# EAGLE schematic SonoluxV1fsch (EAGLE 9.7.0)
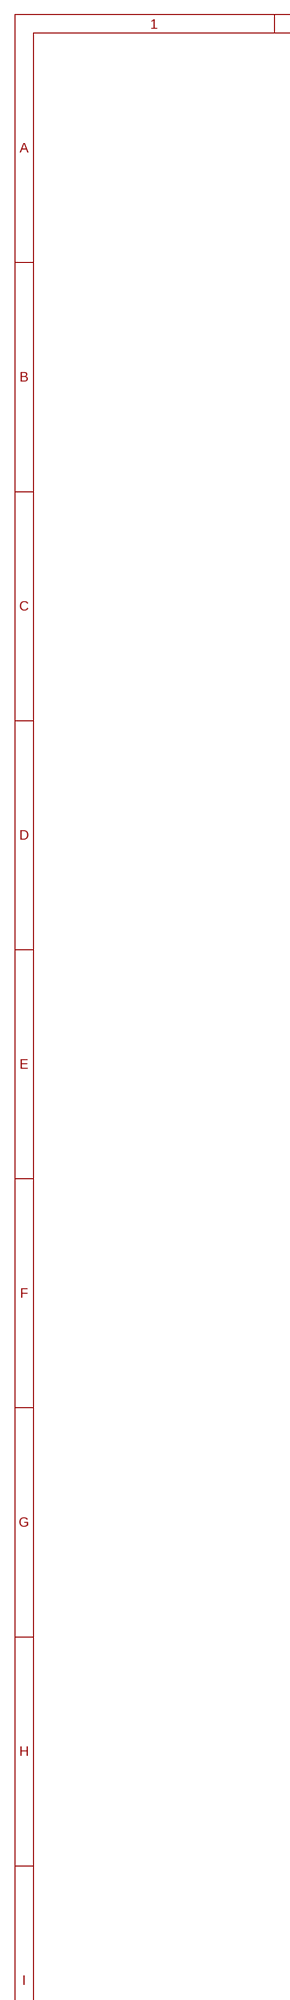
[diagram p0: schematic, sheet 1, part 1 of 2]
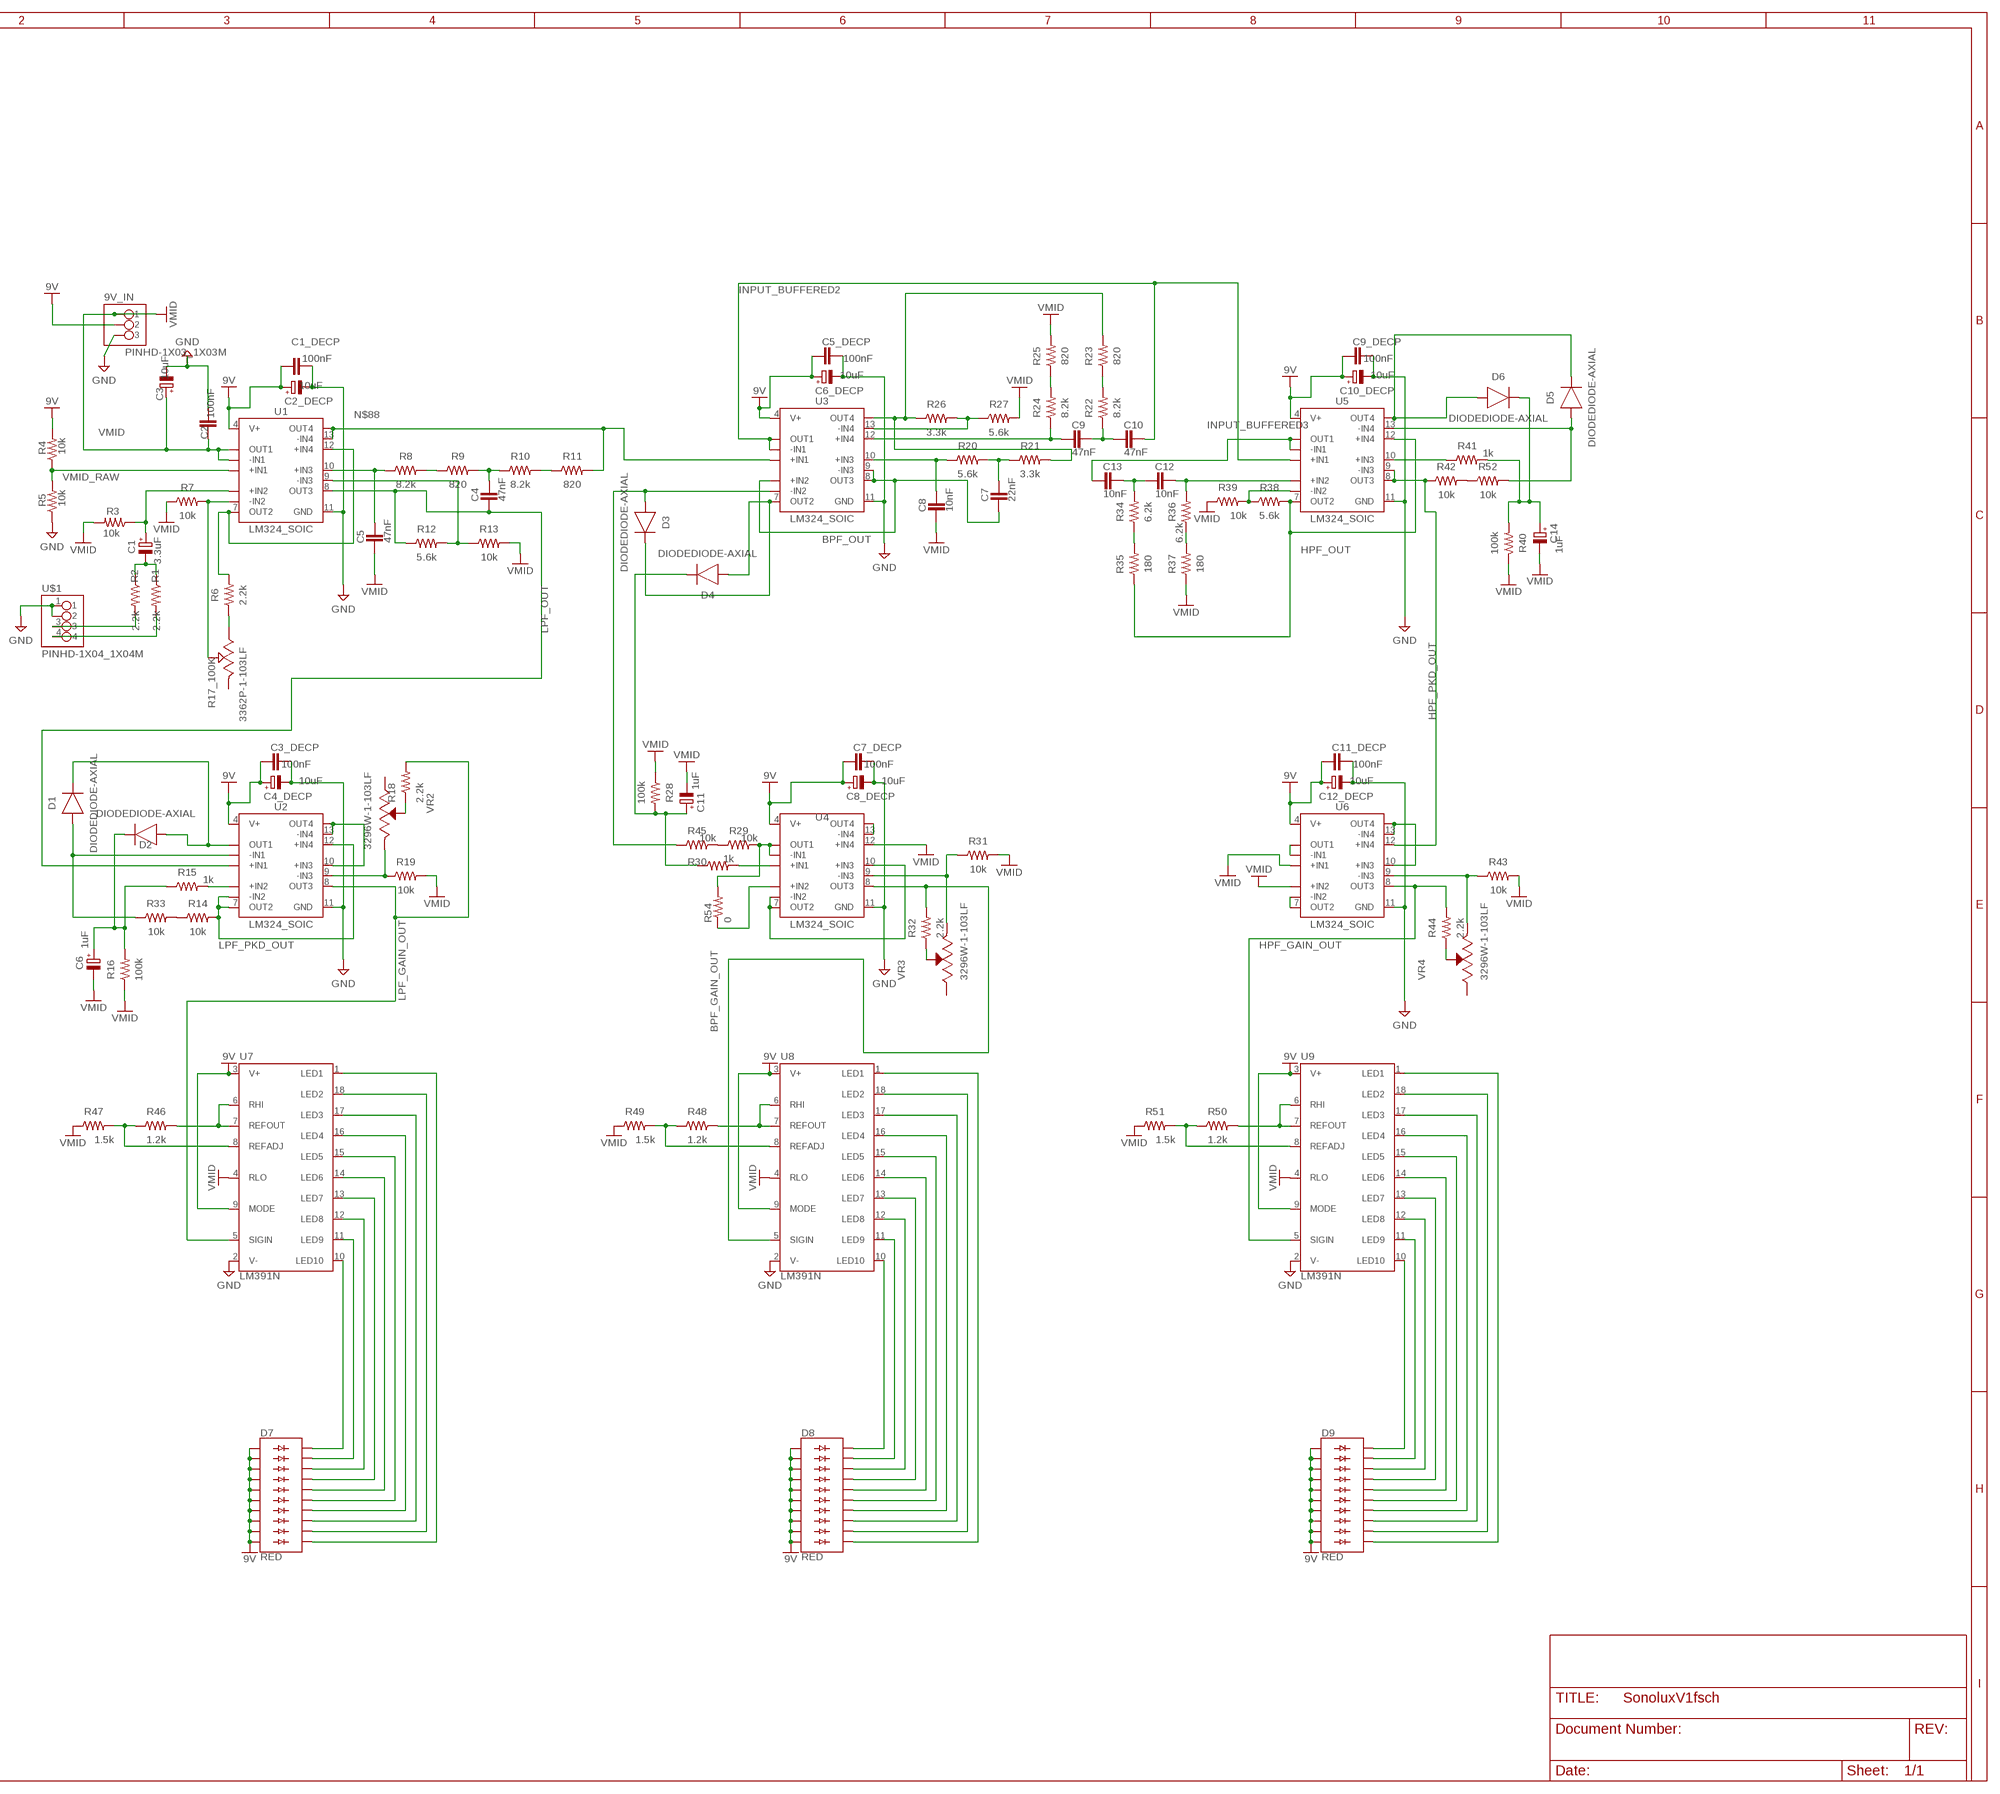
[diagram p1: schematic, sheet 1, part 2 of 2]

## Parts
9V_IN  PINHD-1X03_1X03M  [1X03]
C1  3.3uF  CAPACITOR-POLRADIAL-5MM-DIA  [CAPPRD254W65D500H1150B]
C1_DECP  100nF  CAPACITORCERAMIC-2.54MM  [CAP-THRU-2.54MM]
C2  100nF  CAPACITORCERAMIC-2.54MM  [CAP-THRU-2.54MM]
C2_DECP  10uF  CAPACITOR-POLRADIAL-5MM-DIA  [CAPPRD254W65D500H1150B]
C3  10uF  CAPACITOR-POLRADIAL-5MM-DIA  [CAPPRD254W65D500H1150B]
C3_DECP  100nF  CAPACITORCERAMIC-2.54MM  [CAP-THRU-2.54MM]
C4  47nF  CAPACITORCERAMIC-2.54MM  [CAP-THRU-2.54MM]
C4_DECP  10uF  CAPACITOR-POLRADIAL-5MM-DIA  [CAPPRD254W65D500H1150B]
C5  47nF  CAPACITORCERAMIC-2.54MM  [CAP-THRU-2.54MM]
C5_DECP  100nF  CAPACITORCERAMIC-2.54MM  [CAP-THRU-2.54MM]
C6  1uF  CAPACITOR-POLRADIAL-5MM-DIA  [CAPPRD254W65D500H1150B]
C6_DECP  10uF  CAPACITOR-POLRADIAL-5MM-DIA  [CAPPRD254W65D500H1150B]
C7  22nF  CAPACITORCERAMIC-2.54MM  [CAP-THRU-2.54MM]
C7_DECP  100nF  CAPACITORCERAMIC-2.54MM  [CAP-THRU-2.54MM]
C8  10nF  CAPACITORCERAMIC-2.54MM  [CAP-THRU-2.54MM]
C8_DECP  10uF  CAPACITOR-POLRADIAL-5MM-DIA  [CAPPRD254W65D500H1150B]
C9  47nF  CAPACITORCERAMIC-2.54MM  [CAP-THRU-2.54MM]
C9_DECP  100nF  CAPACITORCERAMIC-2.54MM  [CAP-THRU-2.54MM]
C10  47nF  CAPACITORCERAMIC-2.54MM  [CAP-THRU-2.54MM]
C10_DECP  10uF  CAPACITOR-POLRADIAL-5MM-DIA  [CAPPRD254W65D500H1150B]
C11  1uF  CAPACITOR-POLRADIAL-5MM-DIA  [CAPPRD254W65D500H1150B]
C11_DECP  100nF  CAPACITORCERAMIC-2.54MM  [CAP-THRU-2.54MM]
C12  10nF  CAPACITORCERAMIC-2.54MM  [CAP-THRU-2.54MM]
C12_DECP  10uF  CAPACITOR-POLRADIAL-5MM-DIA  [CAPPRD254W65D500H1150B]
C13  10nF  CAPACITORCERAMIC-2.54MM  [CAP-THRU-2.54MM]
C14  1uF  CAPACITOR-POLRADIAL-5MM-DIA  [CAPPRD254W65D500H1150B]
D1  DIODEDIODE-AXIAL  [DIODE-AXIAL]
D2  DIODEDIODE-AXIAL  [DIODE-AXIAL]
D3  DIODEDIODE-AXIAL  [DIODE-AXIAL]
D4  DIODEDIODE-AXIAL  [DIODE-AXIAL]
D5  DIODEDIODE-AXIAL  [DIODE-AXIAL]
D6  DIODEDIODE-AXIAL  [DIODE-AXIAL]
D7  RED  LED_BARGRAPH_10RED  [LED_BARGRAPH_10]
D8  RED  LED_BARGRAPH_10RED  [LED_BARGRAPH_10]
D9  RED  LED_BARGRAPH_10RED  [LED_BARGRAPH_10]
R1  2.2k  R-US_AXIAL-7.2MM-PITCH  [RESAD724W46L381D178B]
R2  2.2k  R-US_AXIAL-7.2MM-PITCH  [RESAD724W46L381D178B]
R3  10k  R-US_AXIAL-7.2MM-PITCH  [RESAD724W46L381D178B]
R4  10k  R-US_AXIAL-7.2MM-PITCH  [RESAD724W46L381D178B]
R5  10k  R-US_AXIAL-7.2MM-PITCH  [RESAD724W46L381D178B]
R6  2.2k  R-US_AXIAL-7.2MM-PITCH  [RESAD724W46L381D178B]
R7  10k  R-US_AXIAL-7.2MM-PITCH  [RESAD724W46L381D178B]
R8  8.2k  R-US_AXIAL-7.2MM-PITCH  [RESAD724W46L381D178B]
R9  820  R-US_AXIAL-7.2MM-PITCH  [RESAD724W46L381D178B]
R10  8.2k  R-US_AXIAL-7.2MM-PITCH  [RESAD724W46L381D178B]
R11  820  R-US_AXIAL-7.2MM-PITCH  [RESAD724W46L381D178B]
R12  5.6k  R-US_AXIAL-7.2MM-PITCH  [RESAD724W46L381D178B]
R13  10k  R-US_AXIAL-7.2MM-PITCH  [RESAD724W46L381D178B]
R14  10k  R-US_AXIAL-7.2MM-PITCH  [RESAD724W46L381D178B]
R15  1k  R-US_AXIAL-7.2MM-PITCH  [RESAD724W46L381D178B]
R16  100k  R-US_AXIAL-7.2MM-PITCH  [RESAD724W46L381D178B]
R17_100K  3362P-1-103LF  [3362P-1-103LF]
R18  2.2k  R-US_AXIAL-7.2MM-PITCH  [RESAD724W46L381D178B]
R19  10k  R-US_AXIAL-7.2MM-PITCH  [RESAD724W46L381D178B]
R20  5.6k  R-US_AXIAL-7.2MM-PITCH  [RESAD724W46L381D178B]
R21  3.3k  R-US_AXIAL-7.2MM-PITCH  [RESAD724W46L381D178B]
R22  8.2k  R-US_AXIAL-7.2MM-PITCH  [RESAD724W46L381D178B]
R23  820  R-US_AXIAL-7.2MM-PITCH  [RESAD724W46L381D178B]
R24  8.2k  R-US_AXIAL-7.2MM-PITCH  [RESAD724W46L381D178B]
R25  820  R-US_AXIAL-7.2MM-PITCH  [RESAD724W46L381D178B]
R26  3.3k  R-US_AXIAL-7.2MM-PITCH  [RESAD724W46L381D178B]
R27  5.6k  R-US_AXIAL-7.2MM-PITCH  [RESAD724W46L381D178B]
R28  100k  R-US_AXIAL-7.2MM-PITCH  [RESAD724W46L381D178B]
R29  10k  R-US_AXIAL-7.2MM-PITCH  [RESAD724W46L381D178B]
R30  1k  R-US_AXIAL-7.2MM-PITCH  [RESAD724W46L381D178B]
R31  10k  R-US_AXIAL-7.2MM-PITCH  [RESAD724W46L381D178B]
R32  2.2k  R-US_AXIAL-7.2MM-PITCH  [RESAD724W46L381D178B]
R33  10k  R-US_AXIAL-7.2MM-PITCH  [RESAD724W46L381D178B]
R34  6.2k  R-US_AXIAL-7.2MM-PITCH  [RESAD724W46L381D178B]
R35  180  R-US_AXIAL-7.2MM-PITCH  [RESAD724W46L381D178B]
R36  6.2k  R-US_AXIAL-7.2MM-PITCH  [RESAD724W46L381D178B]
R37  180  R-US_AXIAL-7.2MM-PITCH  [RESAD724W46L381D178B]
R38  5.6k  R-US_AXIAL-7.2MM-PITCH  [RESAD724W46L381D178B]
R39  10k  R-US_AXIAL-7.2MM-PITCH  [RESAD724W46L381D178B]
R40  100k  R-US_AXIAL-7.2MM-PITCH  [RESAD724W46L381D178B]
R41  1k  R-US_AXIAL-7.2MM-PITCH  [RESAD724W46L381D178B]
R42  10k  R-US_AXIAL-7.2MM-PITCH  [RESAD724W46L381D178B]
R43  10k  R-US_AXIAL-7.2MM-PITCH  [RESAD724W46L381D178B]
R44  2.2k  R-US_AXIAL-7.2MM-PITCH  [RESAD724W46L381D178B]
R45  10k  R-US_AXIAL-7.2MM-PITCH  [RESAD724W46L381D178B]
R46  1.2k  R-US_AXIAL-7.2MM-PITCH  [RESAD724W46L381D178B]
R47  1.5k  R-US_AXIAL-7.2MM-PITCH  [RESAD724W46L381D178B]
R48  1.2k  R-US_AXIAL-7.2MM-PITCH  [RESAD724W46L381D178B]
R49  1.5k  R-US_AXIAL-7.2MM-PITCH  [RESAD724W46L381D178B]
R50  1.2k  R-US_AXIAL-7.2MM-PITCH  [RESAD724W46L381D178B]
R51  1.5k  R-US_AXIAL-7.2MM-PITCH  [RESAD724W46L381D178B]
R52  10k  R-US_AXIAL-7.2MM-PITCH  [RESAD724W46L381D178B]
R54  0  R-US_AXIAL-7.2MM-PITCH  [RESAD724W46L381D178B]
U1  LM324_SOIC  [SOIC127P600X175-14N]
U2  LM324_SOIC  [SOIC127P600X175-14N]
U3  LM324_SOIC  [SOIC127P600X175-14N]
U4  LM324_SOIC  [SOIC127P600X175-14N]
U5  LM324_SOIC  [SOIC127P600X175-14N]
U6  LM324_SOIC  [SOIC127P600X175-14N]
U7  LM391N  [DIL18]
U8  LM391N  [DIL18]
U9  LM391N  [DIL18]
U$1  PINHD-1X04_1X04M  [1X04]
VR2  3296W-1-103LF  [TRIM_3296W-1-103LF]
VR3  3296W-1-103LF  [TRIM_3296W-1-103LF]
VR4  3296W-1-103LF  [TRIM_3296W-1-103LF]

## Nets
9V: 9V_IN.2 C1_DECP.2 C2_DECP.1(+) C3_DECP.2 C4_DECP.1(+) C5_DECP.2 C6_DECP.1(+) C7_DECP.2 C8_DECP.1(+) C9_DECP.2 C10_DECP.1(+) C11_DECP.2 C12_DECP.1(+) D7.1(A) D7.2(A1) D7.3(A2) D7.4(A3) D7.5(A4) D7.6(A5) D7.7(A6) D7.8(A7) D7.9(A8) D7.10(A9) D8.1(A) D8.2(A1) D8.3(A2) D8.4(A3) D8.5(A4) D8.6(A5) D8.7(A6) D8.8(A7) D8.9(A8) D8.10(A9) D9.1(A) D9.2(A1) D9.3(A2) D9.4(A3) D9.5(A4) D9.6(A5) D9.7(A6) D9.8(A7) D9.9(A8) D9.10(A9) R4.2 U1.4(V+) U2.4(V+) U3.4(V+) U4.4(V+) U5.4(V+) U6.4(V+) U7.3(V+) U7.9(MODE) U8.3(V+) U8.9(MODE) U9.3(V+) U9.9(MODE)
BPF_GAIN_OUT: R32.2 U4.8(OUT3) U8.5(SIGIN)
BPF_OUT: C7.2 U3.5(+IN2) U3.8(OUT3) U3.9(-IN3)
BPF_PKD_OUT: R29.2 R54.2 U4.1(OUT1) U4.2(-IN1)
GND: 9V_IN.3 C1_DECP.1 C2.1 C2_DECP.2(-) C3.2(-) C3_DECP.1 C4_DECP.2(-) C5_DECP.1 C6_DECP.2(-) C7_DECP.1 C8_DECP.2(-) C9_DECP.1 C10_DECP.2(-) C11_DECP.1 C12_DECP.2(-) R5.1 U1.11(GND) U2.11(GND) U3.11(GND) U4.11(GND) U5.11(GND) U6.11(GND) U7.2(V-) U8.2(V-) U9.2(V-) U$1.1 U$1.2
HPF_GAIN_OUT: R44.2 U6.8(OUT3) U9.5(SIGIN)
HPF_OUT: R35.1 R38.2 U5.7(OUT2) U5.12(+IN4)
HPF_PKD_OUT: R42.1 U5.8(OUT3) U5.9(-IN3) U6.12(+IN4)
INPUT_BUFFERED2: C10.1 U3.1(OUT1) U3.2(-IN1) U5.3(+IN1)
INPUT_BUFFERED3: C13.2 U5.1(OUT1) U5.2(-IN1)
INPUT_FILTERED: C1.1(+) R3.1 U1.5(+IN2)
INPUT_GAINED: R6.2 U1.7(OUT2) U1.12(+IN4)
INPUT_MONO: C1.2(-) R1.1 R2.1
LPF_BUFFERED: U2.10(+IN3) U2.13(-IN4) U2.14(OUT4)
LPF_GAIN_OUT: R18.2 U2.8(OUT3) U7.5(SIGIN)
LPF_OUT: C4.2 R12.1 U1.8(OUT3) U2.3(+IN1)
LPF_PKD_OUT: R14.2 U2.6(-IN2) U2.7(OUT2) U2.12(+IN4)
N$1: R6.1 R17_100K.3
N$2: R7.2 R17_100K.2 U1.6(-IN2)
N$3: C5.1 R8.1 U1.10(+IN3)
N$4: R8.2 R9.1
N$5: C4.1 R9.2 R10.1
N$6: R10.2 R11.1
N$7: D1.2(C) D2.1(A) U2.1(OUT1)
N$8: R12.2 R13.1 U1.9(-IN3)
N$9: D1.1(A) R33.1 U2.2(-IN1)
N$10: C9.1 C10.2 R22.1
N$11: C6.1(+) D2.2(C) R15.1 R16.2
N$12: R15.2 U2.5(+IN2)
N$13: C8.1 R20.1 U3.10(+IN3)
N$14: D5.1(A) R52.2 U5.13(-IN4)
N$15: C7.1 R20.2 R21.1
N$16: R18.1 VR2.2(WIPER)
N$18: R21.2 R23.2 R26.1 U3.14(OUT4)
N$19: C9.2 R24.1 U3.12(+IN4)
N$20: R22.2 R23.1
N$21: R24.2 R25.1
N$22: R26.2 R27.1 U3.13(-IN4)
N$23: D3.1(A) R45.1 U3.6(-IN2)
N$24: D3.2(C) D4.1(A) U3.7(OUT2)
N$25: C11.1(+) D4.2(C) R28.2 R30.1
N$26: R32.1 VR3.2(WIPER)
N$27: R30.2 U4.3(+IN1)
N$28: U4.6(-IN2) U4.7(OUT2) U4.10(+IN3)
N$29: R31.1 U4.9(-IN3) VR3.3(CW)
N$30: R38.1 R39.2 U5.6(-IN2)
N$31: C12.2 C13.1 R34.2
N$32: R34.1 R35.2
N$33: R36.1 R37.2
N$34: C12.1 R36.2 U5.5(+IN2)
N$35: D5.2(C) D6.1(A) U5.14(OUT4)
N$36: C14.1(+) D6.2(C) R40.2 R41.2
N$37: R46.2 U7.6(RHI) U7.7(REFOUT)
N$38: R41.1 U5.10(+IN3)
N$39: U6.10(+IN3) U6.13(-IN4) U6.14(OUT4)
N$40: R44.1 VR4.2(WIPER)
N$41: R43.1 U6.9(-IN3) VR4.3(CW)
N$42: R46.1 R47.2 U7.8(REFADJ)
N$43: D7.20(C) U7.10(LED10)
N$44: D7.19(C1) U7.11(LED9)
N$45: D7.18(C2) U7.12(LED8)
N$46: D7.17(C3) U7.13(LED7)
N$47: D7.16(C4) U7.14(LED6)
N$48: D7.15(C5) U7.15(LED5)
N$49: D7.14(C6) U7.16(LED4)
N$50: D7.13(C7) U7.17(LED3)
N$51: D7.12(C8) U7.18(LED2)
N$52: D7.11(C9) U7.1(LED1)
N$53: R48.2 U8.6(RHI) U8.7(REFOUT)
N$54: R48.1 R49.2 U8.8(REFADJ)
N$55: D8.20(C) U8.10(LED10)
N$56: D8.19(C1) U8.11(LED9)
N$57: D8.18(C2) U8.12(LED8)
N$58: D8.17(C3) U8.13(LED7)
N$59: D8.16(C4) U8.14(LED6)
N$60: D8.15(C5) U8.15(LED5)
N$61: D8.14(C6) U8.16(LED4)
N$62: D8.13(C7) U8.17(LED3)
N$63: D8.12(C8) U8.18(LED2)
N$64: D8.11(C9) U8.1(LED1)
N$65: R50.2 U9.6(RHI) U9.7(REFOUT)
N$66: R50.1 R51.2 U9.8(REFADJ)
N$67: D9.20(C) U9.10(LED10)
N$68: D9.19(C1) U9.11(LED9)
N$69: D9.18(C2) U9.12(LED8)
N$70: D9.17(C3) U9.13(LED7)
N$71: D9.16(C4) U9.14(LED6)
N$72: D9.15(C5) U9.15(LED5)
N$73: D9.14(C6) U9.16(LED4)
N$74: D9.13(C7) U9.17(LED3)
N$75: D9.12(C8) U9.18(LED2)
N$76: D9.11(C9) U9.1(LED1)
N$77: R14.1 R33.2
N$78: R29.1 R45.2
N$79: R42.2 R52.1
N$80: U4.13(-IN4) U4.14(OUT4)
N$81: U6.1(OUT1) U6.2(-IN1)
N$82: U6.6(-IN2) U6.7(OUT2)
N$83: R2.2 U$1.3
N$84: R1.2 U$1.4
N$85: R54.1 U4.5(+IN2)
N$86: R19.1 U2.9(-IN3) VR2.3(CW)
N$88: R11.2 U1.13(-IN4) U1.14(OUT4) U3.3(+IN1)
VMID: 9V_IN.1 C2.2 C3.1(+) C5.2 C6.2(-) C8.2 C11.2(-) C14.2(-) R3.2 R7.1 R13.2 R16.1 R19.2 R25.2 R27.2 R28.1 R31.2 R37.1 R39.1 R40.1 R43.2 R47.1 R49.1 R51.1 U1.1(OUT1) U1.2(-IN1) U4.12(+IN4) U6.3(+IN1) U6.5(+IN2) U7.4(RLO) U8.4(RLO) U9.4(RLO)
VMID_RAW: R4.1 R5.2 U1.3(+IN1)
Unconnected: R17_100K.1 VR2.1(CCW) VR3.1(CCW) VR4.1(CCW)

## Library data of the parts
9V_IN = Tinkercad:PINHD-1X03
C1 C2_DECP C3 C4_DECP C6 C6_DECP C8_DECP C10_DECP C11 C12_DECP C14 = Tinkercad:CAPACITOR-POL: Capacitor Polarised - Generic
C1_DECP C2 C3_DECP C4 C5 C5_DECP C7 C7_DECP C8 C9 C9_DECP C10 C11_DECP C12 C13 = Tinkercad:CAPACITOR: Capacitor - Generic
D1-D6 = Tinkercad:DIODE: Diode Rectifier - Generic
D7-D9 = SparkFun-LED:LED_BARGRAPH_10: Young Sun LED Tech - YSLB-10251G5-10 10-Segment LED Bar Graph Features: Red Vf = 2.1V, Ifmax = 20mA Yellow Vf = 2.1V, Ifmax = 20mA Blue Vf = 3.4V, Ifmax = 20mA Green Vf = 3.4V, Ifmax = 20mA SparkFun Products: Red <https://www.sparkfun.com/products/9935> Yellow <https://www.sparkfun.com/products/9936> Green <https://www.sparkfun.com/products/9938> Blue <https://www.sparkfun.com/products/9937>
R1-R5 R54 = Tutorial - Fusion 360:R-US: Resistor Fixed - ANSI
R6-R16 R18-R52 = Resistor:R-US: Resistor Fixed - ANSI
R17_100K = Potentiometer_Trimmers:3362P-1-103LF: TRIMMER 10K OHM 0.5W PC PIN TOP Manufacturer's datasheet <https://www.bourns.com/docs/Product-Datasheets/3362.pdf>
U1-U6 = IC_Linear:LM324: Quad-Operational Amplifiers Reference: Datasheet <https://www.ti.com/lit/ds/snosc16d/snosc16d.pdf>
U7-U9 = SparkFun-IC-Special-Function:LM391: LM3914 Dot/Bar Display Driver TTL/CMOS Logic Drives LEDs, LCDs, Vacuum Fluorecents Source: Data sheet LM3915 <http://www.national.com/ds/LM/LM3915.pdf> Data sheet LM3914 <http://www.national.com/ds/LM/LM3914.pdf> SparkFun Products: MyoWare LED Shield <https://www.sparkfun.com/products/13688> Dot/Bar Display Driver - LM3914 <https://www.sparkfun.com/products/12694>
U$1 = Tinkercad:PINHD-1X04
VR2-VR4 = 3296W-1-103LF:3296W-1-103LF: Check availability <https://pricing.snapeda.com/parts/3296W-1-103LF/Bourns/view-part?ref=eda>